# Altium schematic sheet Control.SchDoc
size A4
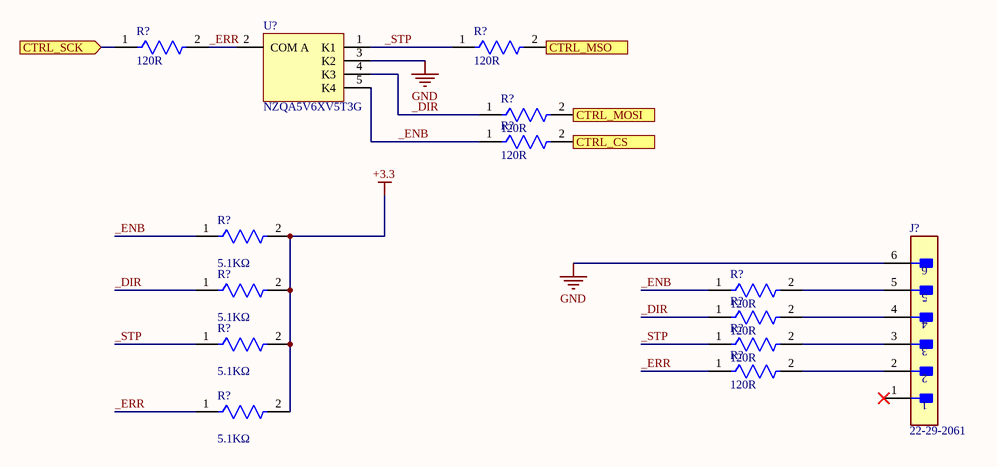
[diagram p0: Control.SchDoc]

## Parts
(Parts that share a designator on the sheet are numbered #1, #2 ... from top to bottom, then left to right.)
J?  22-29-2061  [FP-22-29-2061-MFG]
R?#1  Resistance: 120R  [FP-ERJ2RK-MFG]  (hidden comment: ERJ-2RKF1200X)
R?#2  Resistance: 120R  [FP-ERJ2RK-MFG]  (hidden comment: ERJ-2RKF1200X)
R?#3  Resistance: 120R  [FP-ERJ2RK-MFG]  (hidden comment: ERJ-2RKF1200X)
R?#4  Resistance: 120R  [FP-ERJ2RK-MFG]  (hidden comment: ERJ-2RKF1200X)
R?#5  Resistance: 5.1KΩ  [FP-RT0603-MFG]  (hidden comment: RT0603FRE075K1L)
R?#6  Resistance: 5.1KΩ  [FP-RT0603-MFG]  (hidden comment: RT0603FRE075K1L)
R?#7  Resistance: 120R  [FP-ERJ2RK-MFG]  (hidden comment: ERJ-2RKF1200X)
R?#8  Resistance: 120R  [FP-ERJ2RK-MFG]  (hidden comment: ERJ-2RKF1200X)
R?#9  Resistance: 5.1KΩ  [FP-RT0603-MFG]  (hidden comment: RT0603FRE075K1L)
R?#10  Resistance: 120R  [FP-ERJ2RK-MFG]  (hidden comment: ERJ-2RKF1200X)
R?#11  Resistance: 120R  [FP-ERJ2RK-MFG]  (hidden comment: ERJ-2RKF1200X)
R?#12  Resistance: 5.1KΩ  [FP-RT0603-MFG]  (hidden comment: RT0603FRE075K1L)
U?  NZQA5V6XV5T3G  [ONSC-SOT-553-5-463B_B_V]

## Ports
CTRL_CS (in), CTRL_MOSI (in), CTRL_MSO (in), CTRL_SCK (in)

## Nets
+3.3: R?#5.2 R?#6.2 R?#9.2 R?#12.2
GND: J?.6 U?.3(K2)
_DIR: R?#3.1 R?#6.1 R?#8.1 U?.4(K3)
_ENB: R?#4.1 R?#5.1 R?#7.1 U?.5(K4)
_ERR: R?#1.2 R?#11.1 R?#12.1 U?.2(COM_A)
_STP: R?#2.1 R?#9.1 R?#10.1 U?.1(K1)
CTRL_CS: R?#4.2 ; port CTRL_CS
CTRL_MOSI: R?#3.2 ; port CTRL_MOSI
CTRL_MSO: R?#2.2 ; port CTRL_MSO
CTRL_SCK: R?#1.1 ; port CTRL_SCK
NetJ?_2: J?.2 R?#11.2
NetJ?_3: J?.3 R?#10.2
NetJ?_4: J?.4 R?#8.2
NetJ?_5: J?.5 R?#7.2

Not connected (* = marked no-connect by the designer): J? 1*

## Library data of the parts
J? = CMP-04776-000348-1: CONN HEADER VERT 6POS 2.54MM; Gender: Male; Number of Poles: 6; Voltage Rating: 250V; Insulation Resistance: 50GR; Contact Resistance: 10mR; Current Rating: 4A; Number of Lines: 1; Height: 11.7mm; Mount: Through Hole; Length: 15.24mm; Contact Plating: Gold; Contact Type: Male Pin; Contact Material: Brass; Housing Material: Nylon; Series: KK® 6410; Number of Positions: 6; Contact Mating Length: 0.295inch; Fastening Type: Friction; RoHS Compliant: Yes; Color: Natural; Max Operating Temperature: 75°C; Contact Gender: Male; Packaging: Bulk; Termination: Solder; Voltage Rating (DC): 250V; Orientation: Straight; Radiation Hardening: No; Flammability Rating: UL94 V-0; Package Quantity: 1000; Housing Color: White; Number of Rows: 1; Min Operating Temperature: 0°C; Max Current Rating: 4A; Pitch: 2.54mm; Depth: 5.8mm; Number of Contacts: 6; Lead Free: Lead Free
R?#1-R?#4 R?#7 R?#8 R?#10 R?#11 = CMP-2002-00645-2: RES SMD 120 OHM 1% 1/10W 0402; Voltage Rating (DC): 50V; Temperature Coefficient: 100ppm/°C; Power Rating: 100mW; Case Code (Imperial): 0402; Military Standard: Not; Width: 0.5mm; Technology: THICK FILM; Case Code (Metric): 1005; Lead Free: Lead Free; Radiation Hardening: No; Termination: SMD/SMT; Weight: 0.000388oz; Case/Package: 0402; Resistor Type: Thick Film; Number of Pins: 2; Package Quantity: 10000; Tolerance: 1%; Depth: 0.5mm; RoHS Compliant: Yes; Min Operating Temperature: -55°C; Max Operating Temperature: 155°C; Length: 1mm; Series: ERJ-2Rx; Height: 0.35mm; Mount: Surface Mount; Number of Terminations: 2; Features: Automotive AEC-Q200; Contact Plating: Tin; Voltage Rating: 50V; Max Power Dissipation: 100mW; Packaging: Cut Tape; REACH SVHC: No SVHC
R?#5 R?#6 R?#9 R?#12 = CMP-2000-04778-2: RES SMD 5.1K OHM 1% 1/10W 0603; Manufacturer: Yageo; Value: 5.1KΩ; Temperature Coefficient: 50 ppm/°C; Power Rating: 0.1W; Voltage Rating: 75V; Description: RT0603 5.1KΩ 0.1W 50 ppm/°C 1.00%; Tolerance: 0.01; Lead Free: Yes; Temperature Range High: +155°C; Package: RT0603; Series: RT; Footprint Url: http://www.yageo.com/exep/pages/download/literatures/PYu-R_Mount_10.pdf; Ipc Land Pattern Name: RESC16080X45; Mouser Description: Res Thin Film 0603 5.1K Ohm 1% 0.1W(1/10W) ±50ppm/C Epoxy Pad SMD T/R; Octopart: https://octopart.com/rt0603fre075k1l-yageo-1421390; ComponentLink2URL: http://www.yageo.com/documents/recent/PYu-RT_1-to-0.01_RoHS_L_9.pdf; Manufacturer Part Number: RT0603FRE075K1L; RoHS: TRUE; Device Class L3: Chip SMD Resistors; Digikey Description: RES SMD 5.1K OHM 1% 1/10W 0603; Temperature: -55°C to +155°C; Height: 0.55mm; Automotive: No; Device Class L1: Passive Components; Temperature Range Low: -55°C; Category: Res; Composition: Thin Film; ComponentLink2Description: Datasheet; Device Class L2: Resistors
U? = CMP-1063-00193-1: Quad Array for ESD Protection, 5-Pin SOT-553, Pb-Free, Tape and Reel; Manufacturer: On Semiconductor; Direction: Unidirectional; PPK Max (W): 100; V(BR) Min (V): 5.32; IR Max (uA): 1; VRWM Max (V): 3; Number of Lines: 4; C Max (pF): 90; ComponentLink3Description: Package Specification; ComponentLink2URL: http://www.onsemi.com/pub_link/Collateral/NZQA5V6XV5T1-D.PDF; ComponentLink3URL: http://www.onsemi.com/pub_link/Collateral/NZQA5V6AXV5%20SERIES-D.PDF; PackageDescription: 5-Pin Small Outline Transistor, Body 1.6 x 1.2 mm, Pitch 0.5 mm; Packing: Tape and Reel; RoHS: Pb-Free; Mounting Technology: Surface Mount; PackageReference: SOT-553-5-463B_B; ComponentLink2Description: Datasheet; PartNumber: NZQA5V6XV5T3G; DatasheetVersion: Rev. 3; ComponentLink1Description: Manufacturer URL; PackageVersion: Rev. B, 05/2005; ComponentLink1URL: http://www.onsemi.com/